# EAGLE design nrf51822_board (EAGLE 9.3.2)
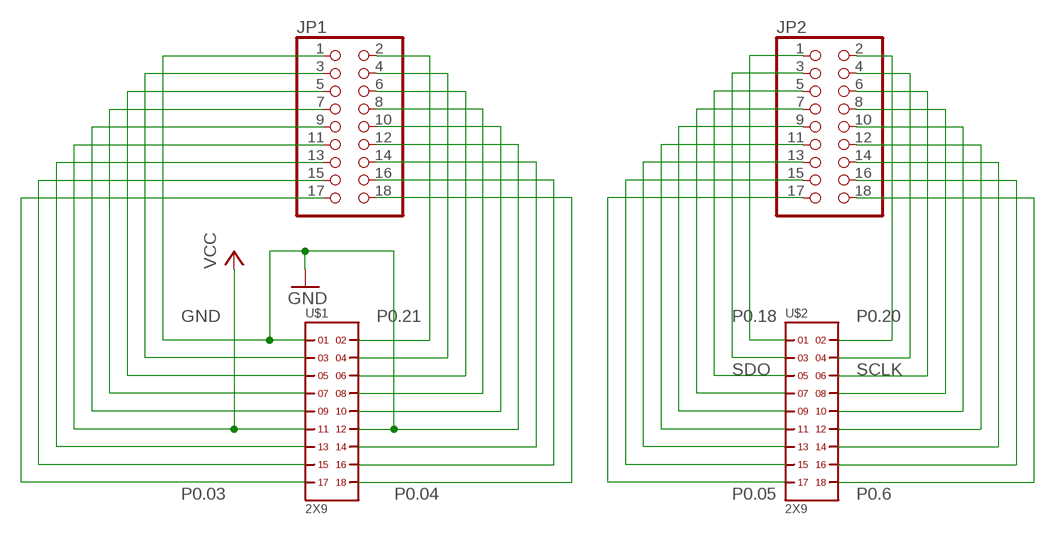
[diagram p0: schematic, sheet 1]

## Parts
JP1  PINHD-2X9  [2X09]
JP2  PINHD-2X9  [2X09]
U$1  2X9  [2X9]
U$2  2X9  [2X9]

## Nets
GND: JP1.1 JP1.12 U$1.1 U$1.12
N$1: JP1.3 U$1.3
N$2: JP1.5 U$1.5
N$3: JP1.7 U$1.7
N$4: JP1.9 U$1.9
N$6: JP1.13 U$1.13
N$7: JP1.15 U$1.15
N$8: JP1.4 U$1.4
N$9: JP1.6 U$1.6
N$10: JP1.8 U$1.8
N$11: JP1.10 U$1.10
N$13: JP1.14 U$1.14
N$14: JP1.16 U$1.16
N$15: JP2.3 U$2.3
N$17: JP2.7 U$2.7
N$18: JP2.9 U$2.9
N$19: JP2.11 U$2.11
N$20: JP2.13 U$2.13
N$21: JP2.15 U$2.15
N$22: JP2.4 U$2.4
N$24: JP2.8 U$2.8
N$25: JP2.10 U$2.10
N$26: JP2.12 U$2.12
N$27: JP2.14 U$2.14
N$28: JP2.16 U$2.16
P0.03: JP1.17 U$1.17
P0.04: JP1.18 U$1.18
P0.05: JP2.17 U$2.17
P0.6: JP2.18 U$2.18
P0.18: JP2.1 U$2.1
P0.20: JP2.2 U$2.2
P0.21: JP1.2 U$1.2
SCLK: JP2.6 U$2.6
SDO: JP2.5 U$2.5
VCC [Vcc]: JP1.11 U$1.11

## Library data of the parts
JP1 JP2 = pinhead:PINHD-2X9: PIN HEADER
U$1 U$2 = headers(2mm):2X9

## Net classes
0 default: width 0.406 mm, clearance 0.254 mm
1 Vcc: width 1.016 mm, clearance 0.254 mm

## Board
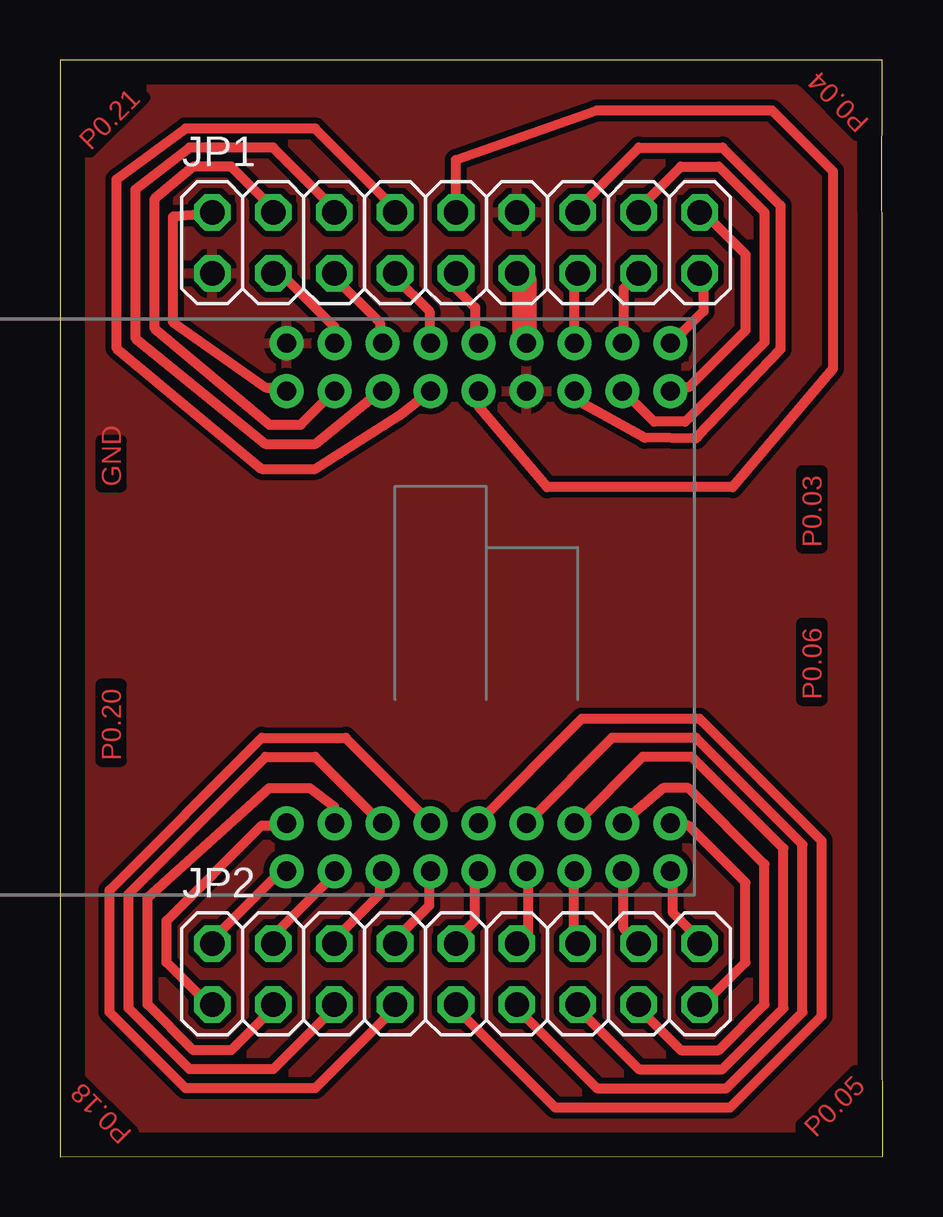
[diagram p1: board, top side]
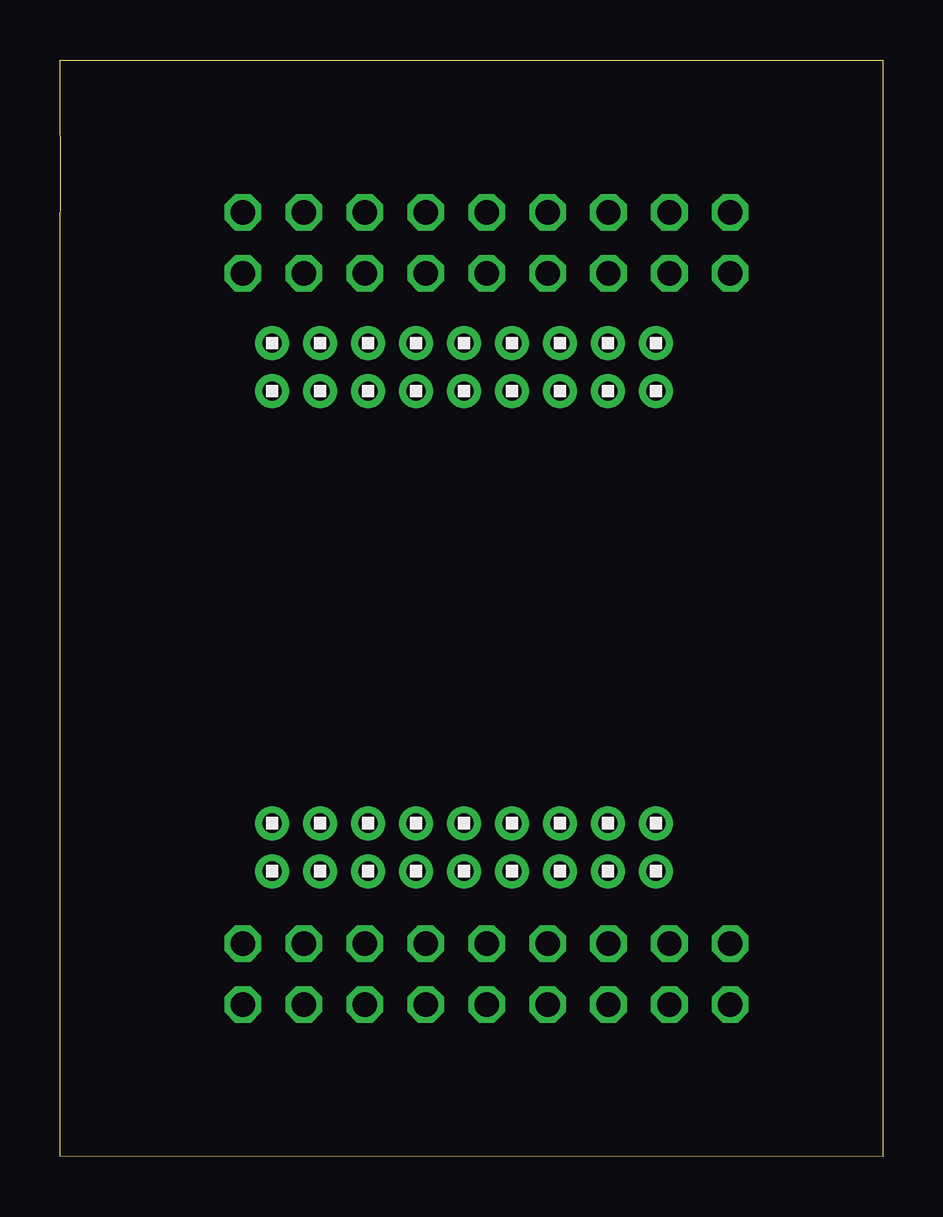
[diagram p2: board, bottom side, seen from below]

Size 34.3 x 45.72 mm. Coordinates in mm from the lower left corner, seen from the top.
Outline: 0,0 34.3,0.02 34.29,6.35 34.29,39.37 34.27,39.42 34.29,45.72 0,45.72 0,0
Copper layers (1*16): Top 0.035mm / dielectric 1.5mm / Bottom 0.035mm
Design rules "default": minimum track width 6mil, minimum drill 0.35mm, track to track 6mil, track to pad 6mil, pad to pad 6mil, via to via 6mil, smd to smd 6mil, copper to edge 40mil, drill to drill 6mil, minimum pad ring 10mil, minimum via ring 8mil, stop-mask expansion 4mil, vias tented up to drill 0mil, thermal gap 10mil

### Footprints (pad centres in the part's own frame; a part is rotated, then mirrored left to right if it is on the bottom)
2X09 = drill 1.016 octagon: 1 -10.16,-1.27; 2 -10.16,1.27; 3 -7.62,-1.27; 4 -7.62,1.27; 5 -5.08,-1.27; 6 -5.08,1.27; 7 -2.54,-1.27; 8 -2.54,1.27; 9 0,-1.27; 10 0,1.27; 11 2.54,-1.27; 12 2.54,1.27; 13 5.08,-1.27; 14 5.08,1.27; 15 7.62,-1.27; 16 7.62,1.27; 17 10.16,-1.27; 18 10.16,1.27
2X9 = drill 0.8 pad 1.422: 1 -8,-1; 2 -8,1; 3 -6,-1; 4 -6,1; 5 -4,-1; 6 -4,1; 7 -2,-1; 8 -2,1; 9 0,-1; 10 0,1; 11 2,-1; 12 2,1; 13 4,-1; 14 4,1; 15 6,-1; 16 6,1; 17 8,-1; 18 8,1

### Placement (x,y rotation side)
JP1  16.51,38.1 0 top
JP2  16.51,7.62 0 top
U$1  17.45,32.92 180 bottom
U$2  17.45,12.9 180 bottom

### Tracks (layer width: path | path; a pad name or v marks a point on that pad's centre or on a via)
GND
  pour Top (isolate 0.254): 0,45.72 0,0 34.29,0 34.29,45.72
N$1
  Top 0.406: JP1.3 9.21,36.83 11.43,34.61 11.43,33.97 U$1.3
N$2
  Top 0.406: JP1.5 11.43,36.67 13.34,34.77 13.34,33.97 U$1.5
N$3
  Top 0.406: JP1.7 13.97,36.67 15.4,35.24 15.4,33.97 U$1.7
N$4
  Top 0.406: JP1.9 16.51,36.2 17.3,35.4 17.3,33.97 U$1.9
N$6
  Top 0.406: JP1.13 21.43,36.67 21.43,33.97 U$1.13
N$7
  Top 0.406: JP1.15 23.5,36.2 23.5,33.97 U$1.15
N$8
  Top 0.406: JP1.4 8.89,39.53 7.14,41.27 5.56,41.27 3.94,39.91 3.94,34.54 8.73,30.51 10.03,30.51 11.43,31.91 U$1.4
N$9
  Top 0.406: JP1.6 11.43,39.53 8.89,42.07 5.4,42.07 3.14,40.32 3.14,34.13 8.57,29.72 10.64,29.72 13.34,31.91 U$1.6
N$10
  Top 0.406: JP1.8 13.97,39.53 10.64,42.86 5.24,42.86 2.35,40.73 2.35,33.72 8.41,28.67 10.64,28.67 14.13,30.89 U$1.8
N$11
  Top 0.406: JP1.10 16.51,41.56 22.38,43.62 29.69,43.62 32.23,41.08 32.23,32.86 28.04,27.91 20.32,27.91 17.46,31.27 17.46,31.91 U$1.10
N$13
  Top 0.406: JP1.14 21.59,39.53 24.13,42.07 27.62,42.07 30.04,39.66 30.04,33.66 26.61,30.06 26.53,29.94 24.37,29.98 21.84,31.37 21.59,31.91 U$1.14
N$14
  Top 0.406: JP1.16 24.13,39.53 25.88,41.27 27.46,41.27 29.37,39.37 29.37,33.94 26.07,30.64 24.77,30.64 23.5,31.91 U$1.16
N$15
  Top 0.406: JP2.3 8.89,6.19 7.14,4.45 5.56,4.45 3.65,6.35 3.65,10.79 8.73,15.37 10.41,15.37 11.43,14.6 11.43,13.97 U$2.3
N$17
  Top 0.406: JP2.7 13.97,6.19 10.64,2.86 5.24,2.86 2.06,6.03 2.06,11.11 8.41,17.46 11.91,17.46 15.4,13.97 U$2.7
N$18
  Top 0.406: JP2.9 16.51,6.19 20.64,2.06 27.94,2.06 31.75,5.87 31.75,13.18 26.67,18.26 21.75,18.26 17.46,13.97 U$2.9
N$19
  Top 0.406: JP2.11 19.05,6.19 22.38,2.86 27.78,2.86 30.96,6.03 30.96,13.02 26.51,17.46 23.02,17.46 19.53,13.97 U$2.11
N$20
  Top 0.406: JP2.13 21.59,6.19 24.13,3.65 27.62,3.65 30.16,6.19 30.16,12.86 26.35,16.67 24.29,16.67 21.59,13.97 U$2.13
N$21
  Top 0.406: JP2.15 24.13,6.19 25.88,4.45 27.46,4.45 29.37,6.35 29.37,12.19 26.19,15.37 25.15,15.37 23.5,13.97 U$2.15
N$22
  Top 0.406: JP2.4 8.89,9.21 11.43,11.75 U$2.4
N$24
  Top 0.406: JP2.8 13.97,9.05 15.4,10.48 15.4,11.75 U$2.8
N$25
  Top 0.406: JP2.10 16.51,9.05 17.3,9.84 17.3,11.75 U$2.10
N$26
  Top 0.406: JP2.12 19.53,9.37 19.53,11.75 U$2.12
N$27
  Top 0.406: JP2.14 21.43,9.05 21.43,11.75 U$2.14
N$28
  Top 0.406: JP2.16 23.5,9.52 23.5,11.75 U$2.16
P0.03
  Top 0.406: JP1.17 26.83,36.67 26.83,35.24 25.56,33.97 U$1.17
P0.04
  Top 0.406: JP1.18 26.83,39.37 28.57,37.62 28.57,34.45 26.19,32.07 25.56,32.07 U$1.18
P0.05
  Top 0.406: JP2.17 26.83,6.35 28.57,8.1 28.57,11.43 26.19,13.81 25.56,13.81 U$2.17
P0.6
  Top 0.406: JP2.18 26.67,9.05 25.56,10.16 25.56,11.75 U$2.18
P0.18
  Top 0.406: JP2.1 6.19,6.35 4.45,8.1 4.45,9.84 8.41,13.81 9.37,13.81 U$2.1
P0.20
  Top 0.406: JP2.2 6.35,9.05 9.05,11.75 9.37,11.75 U$2.2
P0.21
  Top 0.406: JP1.2 6.35,39.31 4.7,39.18 4.7,34.8 8.57,32.07 9.37,32.07 U$1.2
SCLK
  Top 0.406: JP2.6 11.43,9.05 13.34,10.95 13.34,11.75 U$2.6
SDO
  Top 0.406: JP2.5 11.43,6.19 8.89,3.65 5.4,3.65 2.86,6.19 2.86,10.95 8.57,16.67 10.64,16.67 13.34,13.97 U$2.5
VCC
  Top 1.016: JP1.11 19.37,36.51 19.37,33.97 U$1.11

### Text on the board
Top: P0.04 | P0.21 | GND | P0.03 | P0.06 | P0.20 | P0.18 | P0.05